# Altium schematic sheet Voltage Regulation.SchDoc
size A4; SheetNumber: 4; SheetTotal: 8
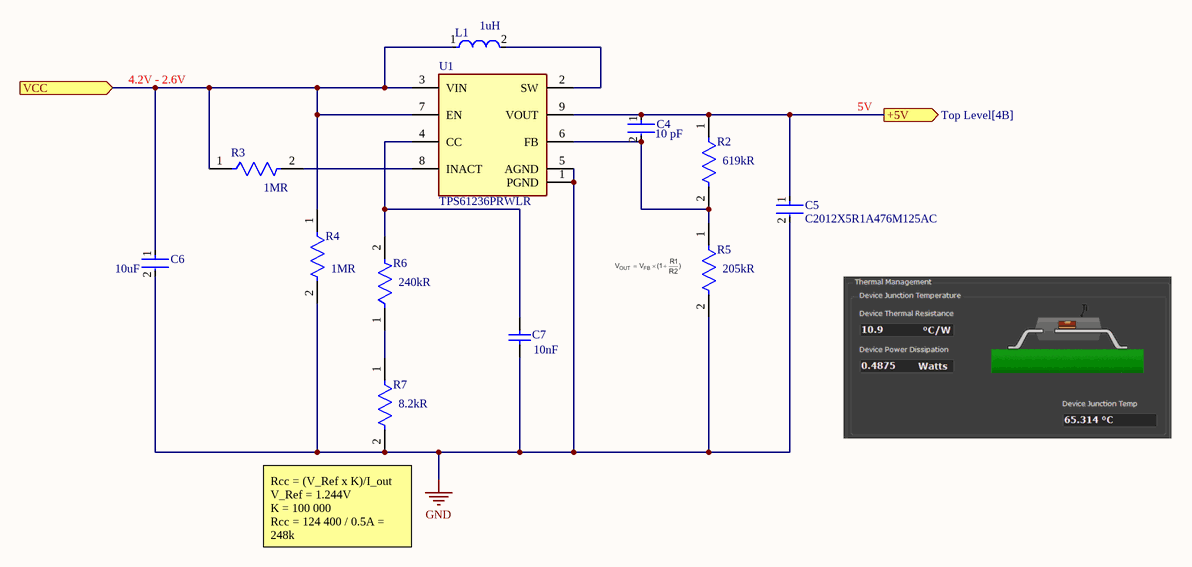
[diagram p0: Voltage Regulation.SchDoc]

## Parts
C4  value 10 pF  [FP-C0805C-DN-MFG]  (hidden comment: C0805C100M4GACTU)
C5  C2012X5R1A476M125AC  [FP-C2012-125-0_2-IPC_B]
C6  Capacitance: 10uF  [FP-GRM21B-0_15-IPC_A]  (hidden comment: GRM21BR61E106MA73L)
C7  Capacitance: 10nF  [CAPC1005X55X25NL05T10]  (hidden comment: GRM155R61A103KA01D)
L1  Inductance: 1uH  [FP-DFE201612C-MFG]  (hidden comment: 1286AS-H-1R0M=P2)
R2  Resistance: 619kR  [FP-CRCW0402-e3-IPC_C]  (hidden comment: CRCW0402619KFKED)
R3  Resistance: 1MR  [FP-CRCW0402-C-e3-MFG]  (hidden comment: CRCW04021M00FKEDC)
R4  Resistance: 1MR  [FP-CRCW0402-C-e3-MFG]  (hidden comment: CRCW04021M00FKEDC)
R5  Resistance: 205kR  [FP-AC0402-MFG]  (hidden comment: AC0402FR-07205KL)
R6  Resistance: 240kR  [FP-ESR03-MFG]  (hidden comment: ESR03EZPJ244)
R7  Resistance: 8.2kR  [FP-CRCW2010-e3-IPC_C]  (hidden comment: CRCW20108K20JNEF)
U1  TPS61236PRWLR  [TPS61235PRWLT]

## Ports
+5V (out, see Top Level[4B]), VCC (in, see Top Level[4B], Charging System[3B])

## Nets
GND: C5.2 C6.2 C7.2 R4.2 R5.2 R7.2 U1.1(PGND) U1.5(AGND)
+5V: C4.1 C5.1 R2.1 U1.9(VOUT) ; port +5V
VCC: C6.1 L1.1 R3.1 R4.1 U1.3(VIN) U1.7(EN) ; port VCC
NetC4_2: C4.2 R2.2 R5.1 U1.6(FB)
NetC7_1: C7.1 R6.2 U1.4(CC)
NetL1_2: L1.2 U1.2(SW)
NetR3_2: R3.2 U1.8(INACT)
NetR6_1: R6.1 R7.1

## Notes on the sheet
- 4.2V - 2.6V
- 5V
- (near R7) Rcc = (V_Ref x K)/I_out
  V_Ref = 1.244V
  K = 100 000
  Rcc = 124 400 / 0.5A = 248k

## Library data of the parts
C4 = CMP-1036-00838-4: CAP CER 10PF 16V 20% NP0 0805; Manufacturer: KEMET; Material: Ceramic; Tolerance: 0.2; Temperature Characteristic: C0G; Temperature Coefficient: 30ppm/°C; Height: 0.88mm; Mouser Description: Multilayer Ceramic Capacitors MLCC - SMD/SMT 16volts 10pF C0G 20%; Device Class L2: Capacitors; Temperature Range Low: -55°C; Manufacturer Part Number: C0805C100M4GACTU; ComponentLink2URL: https://content.kemet.com/datasheets/KEM_C1003_C0G_SMD.pdf; Category: Cap; Octopart: https://octopart.com/c0805c100m4gactu-kemet-16430157; Device Class L1: Passive Components; Capacitance: 10 pF; Temperature: -55°C to +125°C; RoHS: TRUE; Package: C0805C-DN; Device Class L3: Ceramic Capacitors; Automotive: No; Voltage Rating: 16 V; Digikey Description: CAP CER 10PF 16V 20% NP0 0805; Temperature Range High: +125°C; Ipc Land Pattern Name: CAPC200125X78; Lead Free: Yes; ComponentLink2Description: Datasheet
C5 = CMP-2000-05451-2: Multilayer Ceramic Capacitors 47μF ±20% 10V X5R SMD 0805; Capacitance: 47uF; RoHS Compliant: Yes; Dielectric: X5R; Case Code (Imperial): 0805; Min Operating Temperature: -55°C; Length: 2mm; Voltage Rating: 10V; Lead Free: Lead Free; Weight: 0.000194oz; Resistor Type: Ceramic; Dielectric Material: Ceramic; Max Operating Temperature: 85°C; Height: 1.25mm; Width: 0.049inch; Depth: 1.25mm; Termination: SMD/SMT; Case/Package: 0805; Voltage Rating (DC): 10V; Voltage: 10V; Thickness: 0.057inch; Tolerance: 20%; REACH SVHC: No SVHC; Package Quantity: 1; Series: C; Case Code (Metric): 2012; Mount: Surface Mount; Packaging: Tape and Reel
C6 = CMP-06035-013048-1: Chip Multilayer Ceramic Capacitors for General Purpose, 0805, 10uF, X5R, 15%, 20%, 25V; Max Operating Temperature: 85°C; Package Quantity: 3000; Case/Package: 0805; Depth: 1.25mm; Case Code (Imperial): 0805; Termination: SMD/SMT; Width: 0.049inch; Packaging: Tape and Reel; Tolerance: 20%; Height: 1.25mm; Min Operating Temperature: -55°C; Weight: 0.000335oz; Voltage Rating (DC): 25V; Dielectric: X5R; Length: 2mm; Thickness: 0.055inch; Voltage Rating: 25V; Resistor Type: Ceramic; Lead Free: Lead Free; Case Code (Metric): 2012; Mount: Surface Mount; REACH SVHC: No SVHC
C7 = CMP-2008-03935-1: Manufacturer: Murata; Part Number: GRM155R61A103KA01D
L1 = CMP-06042-000171-1: FIXED IND 1UH 2.5A 82 MOHM SMD; Tolerance: 20%; Core Material: Ferrite; Max DC Current: 2.3A; Shielding: Shielded; DC Resistance (DCR): 82mR; Test Frequency: 1MHz; Packaging: Tape and Reel; Case Code (Metric): 2016; Depth: 1.6mm; Min Operating Temperature: -40°C; Current Rating: 2.5A; Case/Package: 0806; Case Code (Imperial): 0806; Height - Seated (Max): 0.047inch; Length: 0.079inch; Max Operating Temperature: 85°C; Mount: Surface Mount; Resistor Type: Wirewound; Width: 0.063inch
R2 = CMP-1011-00826-5: RES Thick Film, 619kΩ, 1%, 0.063W, 100ppm/°C, 0402; Voltage Rating: 50V; Power Rating: 63mW; Width: 0.02inch; Case Code (Metric): 1005; Tolerance: 1%; Case Code (Imperial): 0402; Lead Free: Lead Free; Case/Package: 0402; Radiation Hardening: No; Termination: Solder; Voltage Rating (DC): 50V; Number of Terminations: 2; Depth: 0.5mm; Length: 1mm; Contact Plating: Tin; Temperature Coefficient: 100ppm/°C; Max Power Dissipation: 63mW; Weight: 2.3E-05oz; Height: 0.35mm; Military Standard: Not; Package Quantity: 10; Composition: Thick Film; Max Operating Temperature: 155°C; Packaging: Tape and Reel; Min Operating Temperature: -55°C; Features: Automotive AEC-Q200
R3 R4 = CMP-02407-013080-1: RES 1M OHM 1% 1/16W 0402; Max Power Dissipation: 63mW; Temperature Coefficient: 100ppm/°C; Power Rating: 62.5mW; Tolerance: 1%; Contact Plating: Tin; Max Operating Temperature: 155°C; Number of Terminations: 2; Min Operating Temperature: -55°C; Lead Free: Lead Free; Length: 1mm; RoHS Compliant: Yes; Series: CRCW-C; Case/Package: 0402; Packaging: Tape and Reel; Mount: Surface Mount; Resistor Type: Thick Film; Termination: Wraparound
R5 = CMP-03412-004258-2: RES 205kΩ ±1% 0.063W 0402; Power Rating: 62.5mW; Max Power Dissipation: 63mW; Temperature Coefficient: 100ppm/°C; Voltage Rating: 50V; Series: AC; Weight: 2.3E-05oz; Max Operating Temperature: 155°C; Case Code (Imperial): 0402; Resistor Type: Thick Film; Length: 0.039inch; Min Operating Temperature: -55°C; Ratings: AEC-Q200; Case Code (Metric): 1005; Tolerance: 1%; Packaging: Tape and Reel; Termination: SMD/SMT; Features: Moisture Resistant; Case/Package: 0402; RoHS Compliant: Yes; Number of Terminations: 2; Width: 0.5mm; Height: 0.015inch
R6 = CMP-08839-028178-1: 240kΩ ±5% 0.25W 0603 Anti-Surge Chip Resistor AEC-Q200; Temperature Coefficient: 200ppm/°C; Max Power Dissipation: 250mW; Min Operating Temperature: -55°C; Packaging: Tape and Reel; Max Operating Temperature: 155°C; Case/Package: 0603; Series: ESR; Tolerance: 5%; Features: Automotive AEC-Q200; RoHS Compliant: Yes; Case Code (Metric): 1608; Number of Terminations: 2; Package Quantity: 5000; Width: 0.031inch; Case Code (Imperial): 0603; Resistor Type: Thick Film; Height: 0.022inch; Length: 0.063inch
R7 = CMP-02407-002670-1: RES Thick Film, 8.2kΩ, 5%, 0.75W, 200ppm/°C, 2010; Voltage Rating: 400V; Power Rating: 750mW; Composition: Thick Film; Package Quantity: 4000; Contact Plating: Tin; Depth: 2.5mm; Case Code (Imperial): 2010; Tolerance: 5%; Weight: 0.000899oz; Length: 5mm; Height: 0.6mm; Temperature Coefficient: 200ppm/°C; Termination: SMD/SMT; Voltage Rating (DC): 400V; Lead Free: Lead Free; Case Code (Metric): 5025; Case/Package: 2010; Military Standard: Not; Radiation Hardening: No; Packaging: Tape and Reel; Max Operating Temperature: 155°C; Min Operating Temperature: -55°C; Width: 2.5mm
U1 = TPS61236PRWLR: Integrated Circuit; Manufacturer_Name: Texas Instruments; Datasheet Link: http://www.ti.com/lit/ds/symlink/tps61236p.pdf; Manufacturer_Part_Number: TPS61236PRWLR; Mouser Part Number: 595-TPS61236PRWLR; Mouser Price/Stock: https://www.mouser.co.uk/ProductDetail/Texas-Instruments/TPS61236PRWLR?qs=LuYMPh7GGMSj5RXH1N1%2Fpw%3D%3D; Arrow Part Number: TPS61236PRWLR; Arrow Price/Stock: https://www.arrow.com/en/products/tps61236prwlr/texas-instruments?region=nac